# EasyEDA Pro project PicoMiteVGAUSBV1.1.eprj, board PCB3
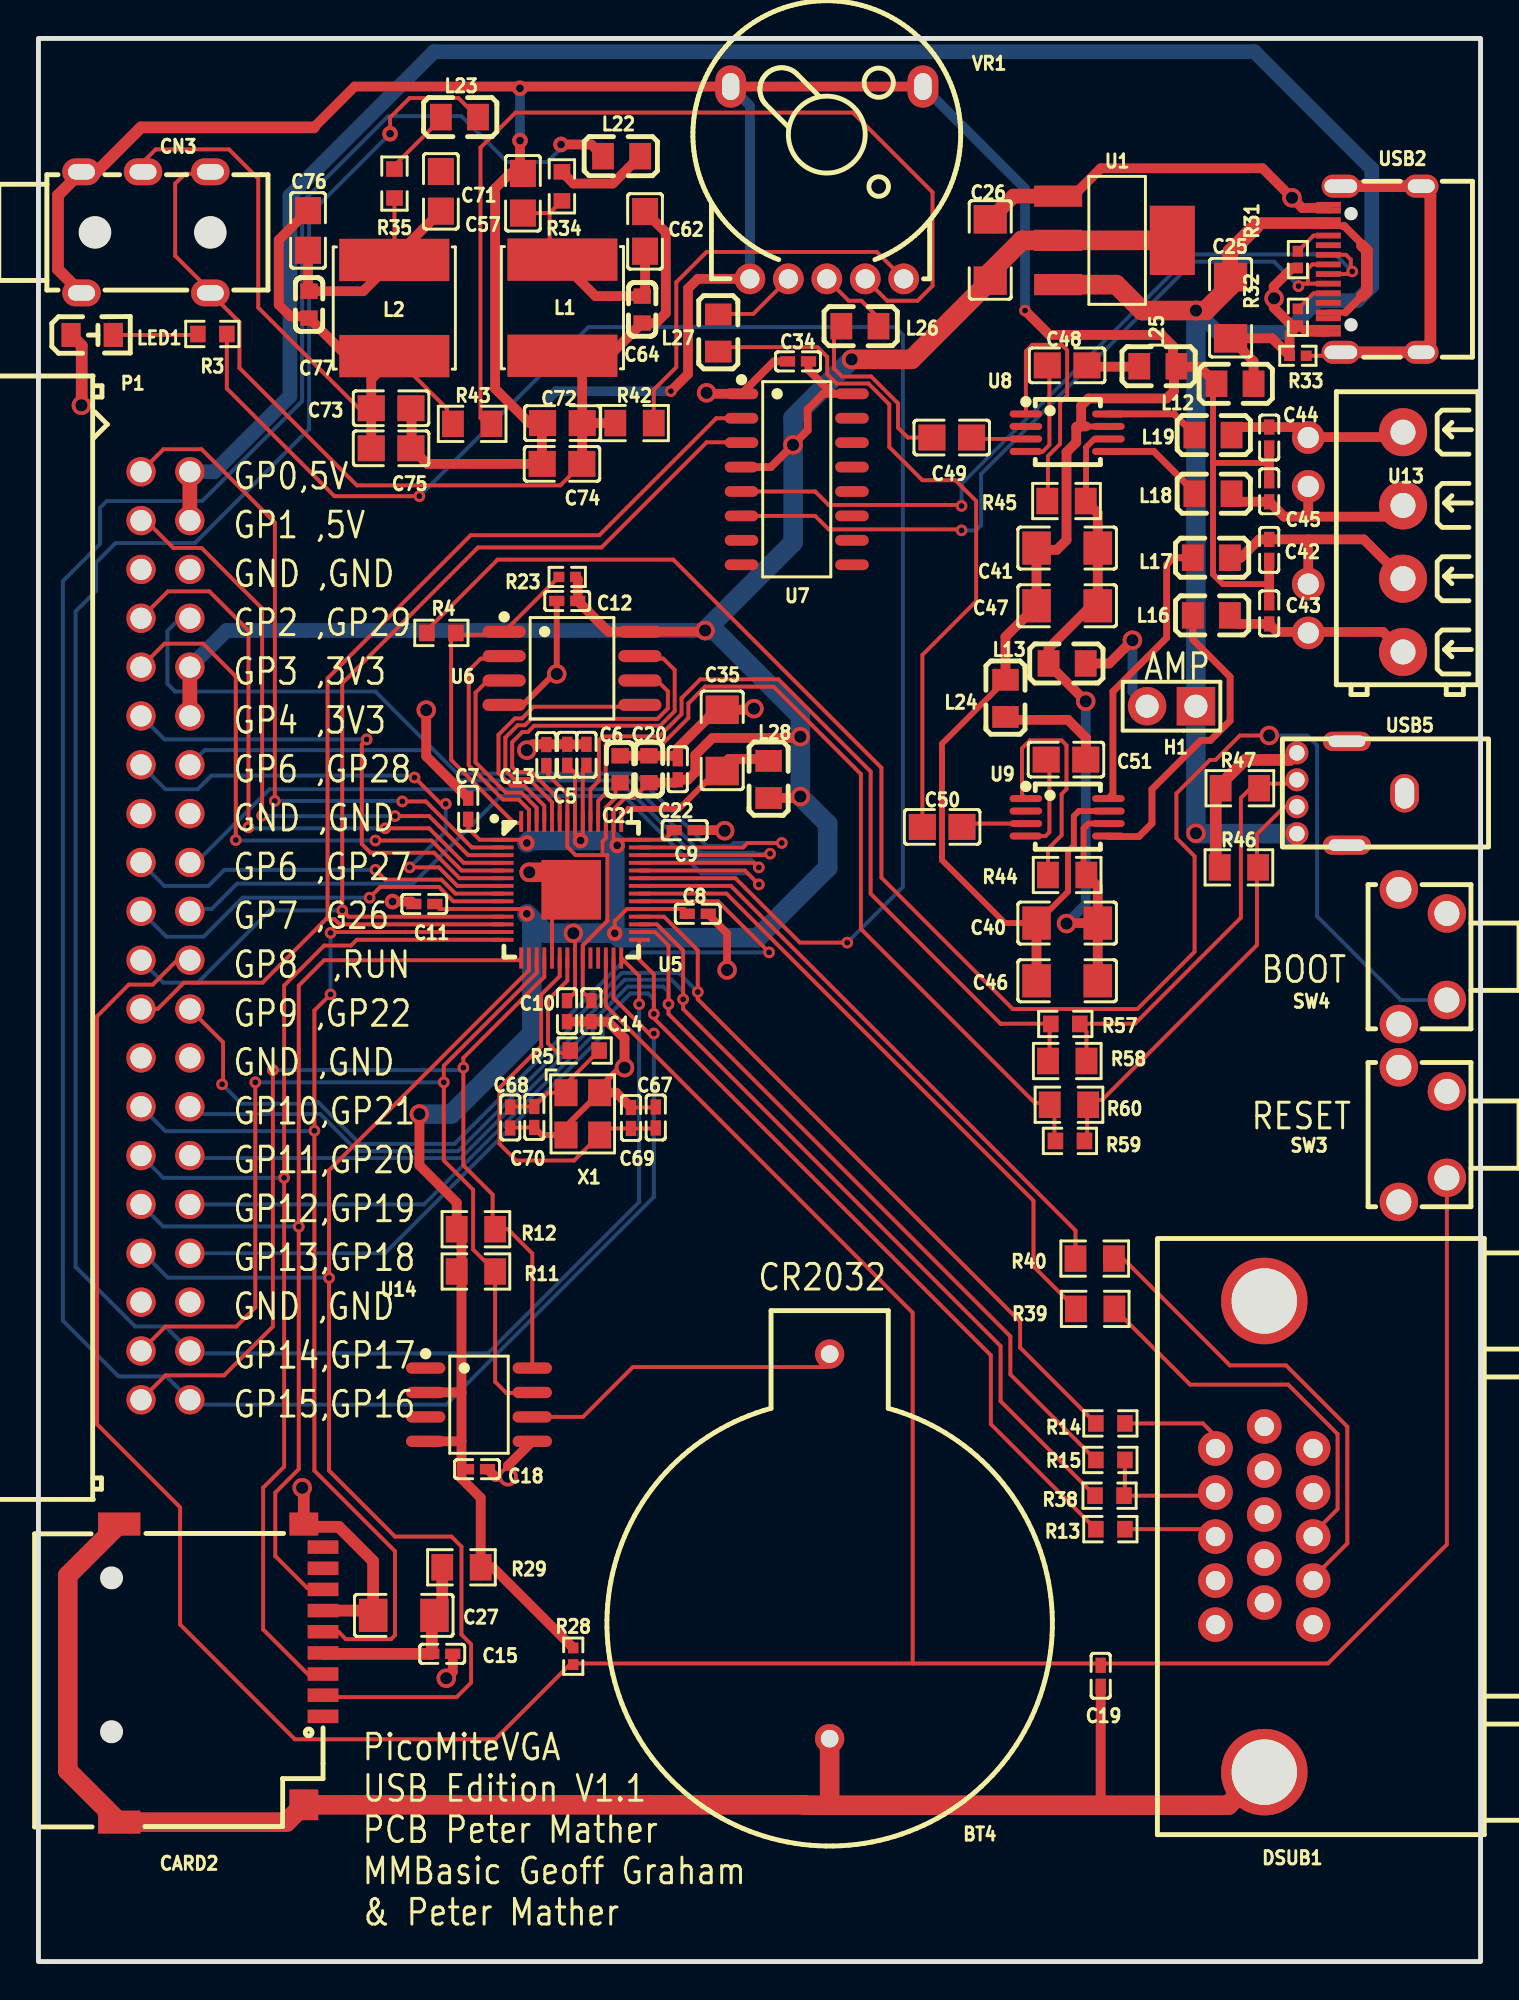
[diagram p1: board, top side]
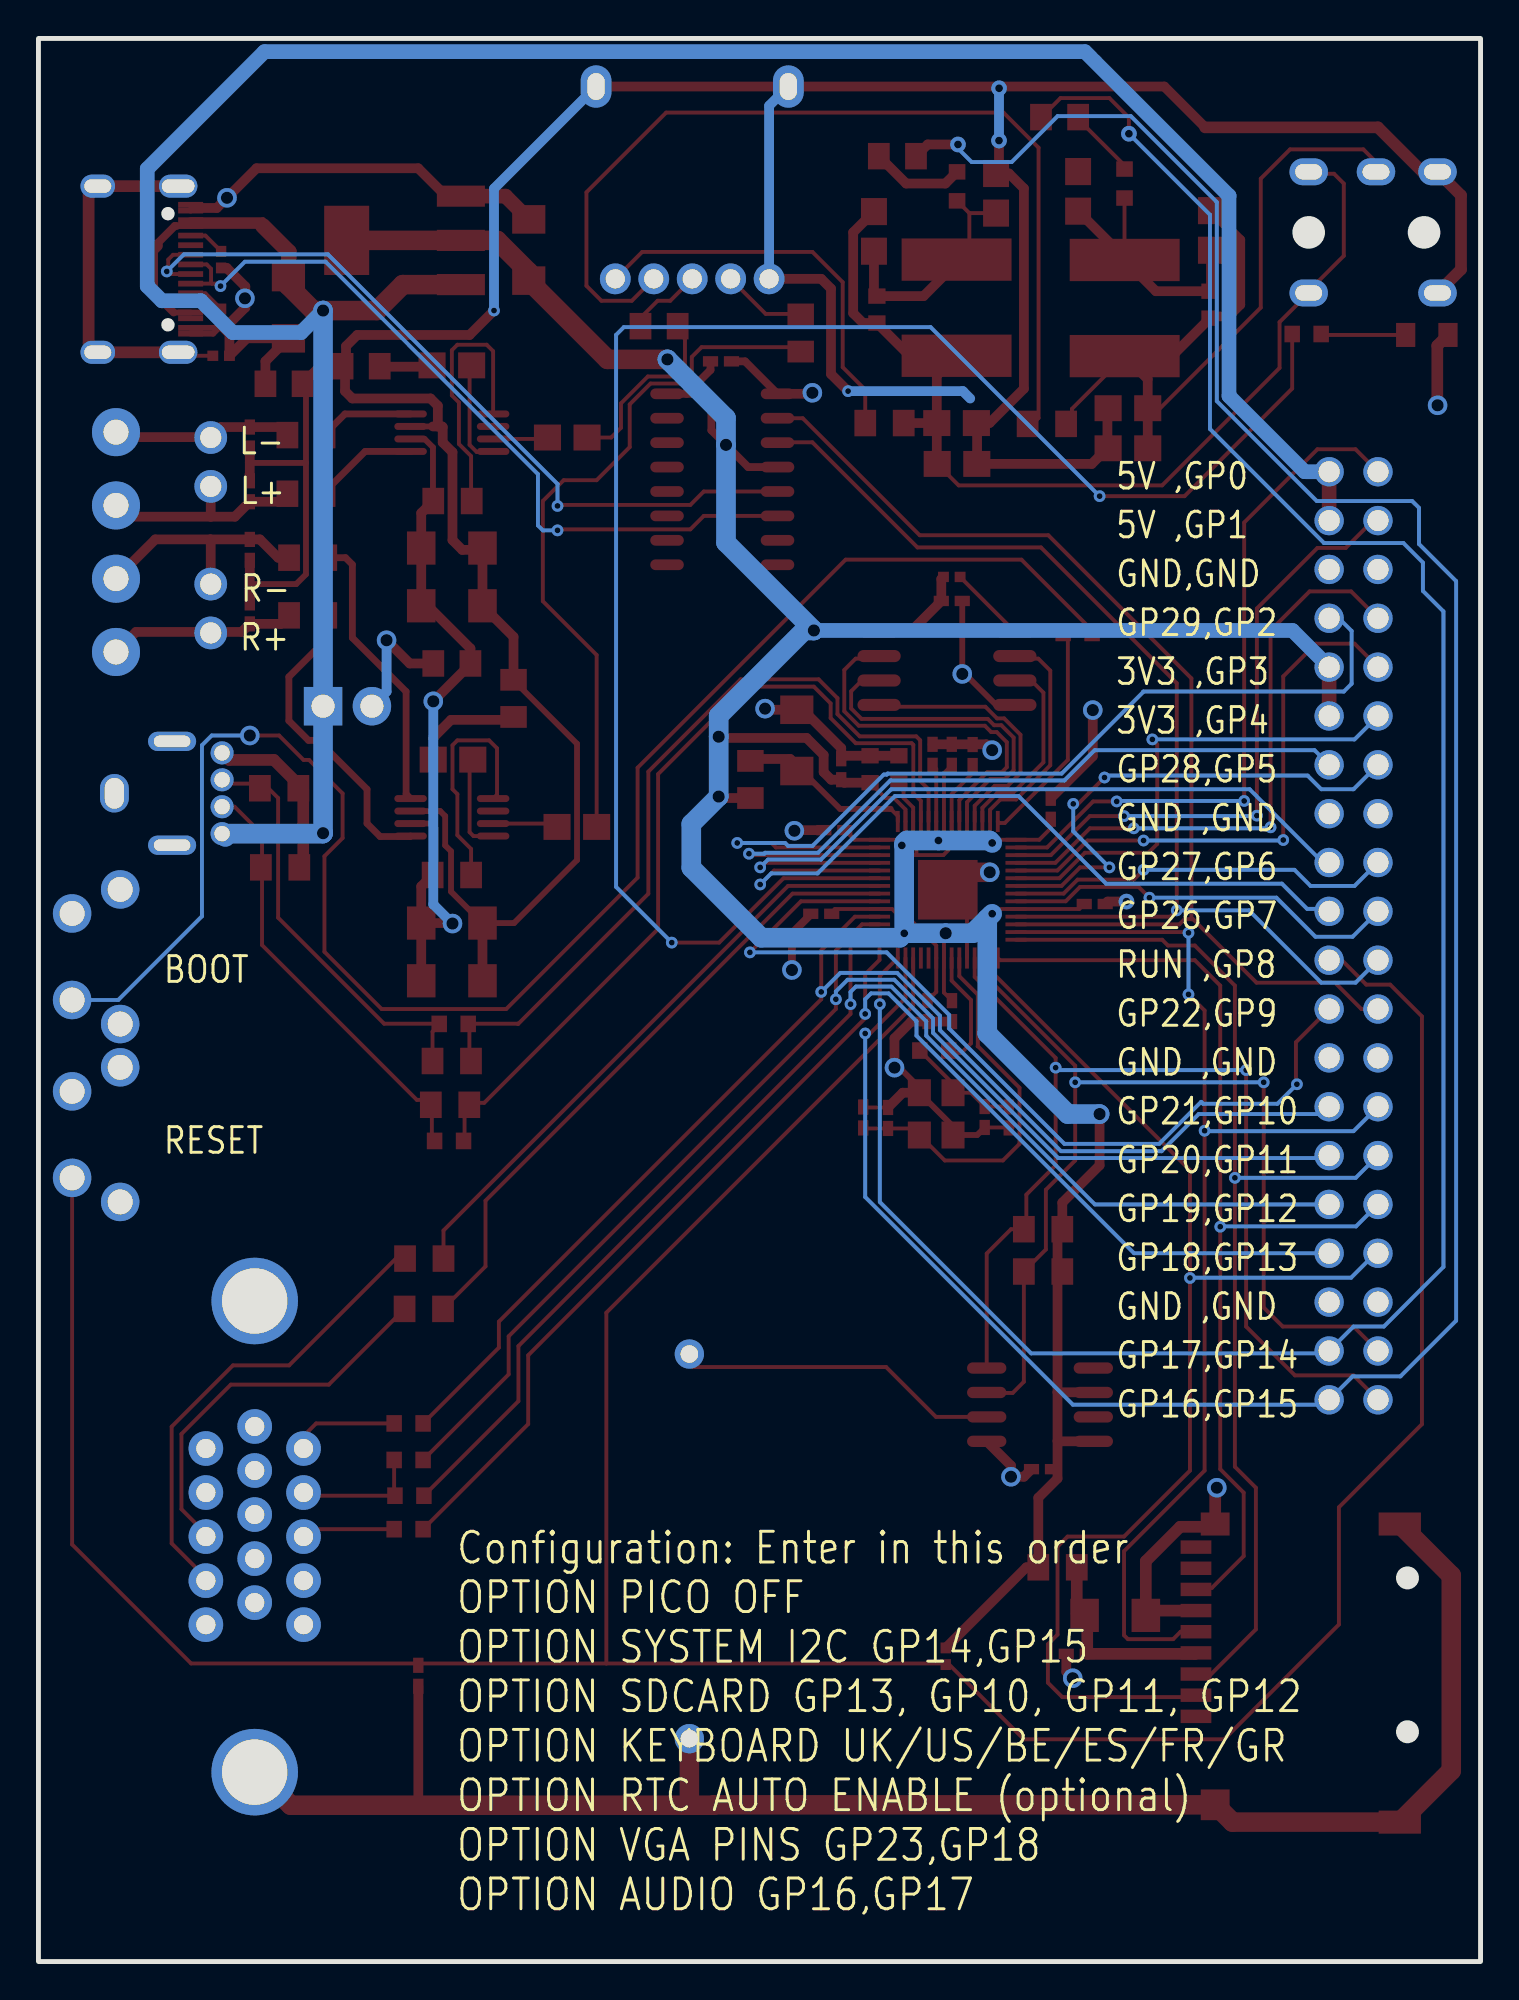
[diagram p2: board, bottom side, seen from below]

Outline 75 x 100 mm; copper layers: Top Layer, Bottom Layer. Coordinates in mm from the lower left corner of the outline.
Outline path: rectangle 75,0 0,100
Stack: Top Layer 0.035mm / Dielectric1 1.51mm FR4 er 4.5 / Bottom Layer 0.035mm

## Design rules (mm)
spacing safeClearance (default): track to track 0.152, other pairs 0.152 to 0.3
track width trackWidth (default): min 0.127, default 0.254, max 2.54
differential pair differentialPair (default): width min 0.127, default 0.254, max 2.54; gap min 0.152, default 0.152
via viaSize (default): diameter min 0.5, default 0.61, max 10; hole min 0.3, default 0.305, max 6

## Placement (name value [footprint] x y rotation side)
BT4  BS-04-A1BJ005  [BAT-TH_BS-04-A1BJ004]  41.15 21.59 90 top
C5  100nF  [C0402_NEW]  27.5 62.75 270 top
C6  100nF  [C0402_NEW]  28.5 62.75 270 top
C7  100nF  [C0402_NEW]  22.35 59.94 270 top
C8  100nF  [C0402_NEW]  34.29 54.48 180 top
C9  100nF  [C0402_NEW]  33.61 58.83 180 top
C10  100nF  [C0402_NEW]  27.49 49.42 90 top
C11  100nF  [C0402_NEW]  20.07 54.99 0 top
C12  100nF  [C0402_NEW]  27.5 70.75 0 top
C13  100nF  [C0402_NEW]  26.42 62.74 90 top
C14  100nF  [C0402_NEW]  28.76 49.42 270 top
C15  100nF  [C0402_NEW]  21 16 0 top
C18  100nF  [C0402_NEW]  22.81 25.6 180 top
C19  100nF  [C0402_NEW]  55.25 14.86 90 top
C20  2.2uF  [C0603]  31.75 62 270 top
C21  2.2uF  [C0603]  30.25 62 90 top
C22  100nF  [C0402_NEW]  33.25 62 270 top
C25  10uF  [C1206]  62 86 90 top
C26  10uF  [C1206]  49.5 89 270 top
C27  10uF  [C1206]  19 18 180 top
C34  100nF  [C0402_NEW]  39.5 83.21 180 top
C35  10uF  [C1206]  35.56 63.5 270 top
C40  10uF  [C1206]  53.5 54 180 top
C41  10uF  [C1206]  53.5 73.5 180 top
C42  220pF  [C0402]  64.01 73.41 90 top
C43  220pF  [C0402]  64.01 70.1 270 top
C44  220pF  [C0402]  64.01 79.25 90 top
C45  220pF  [C0402]  64.01 76.45 270 top
C46  1uF  [C1206]  53.5 51 0 top
C47  1uF  [C1206]  53.5 70.5 0 top
C48  100nF  [C0805]  53.5 83 180 top
C49  100nF  [C0805]  47.5 79.25 0 top
C50  100nF  [C0805]  47 59 0 top
C51  100nF  [C0805]  53.44 62.5 180 top
C57  33nF  [C0805]  25.2 91.95 270 top
C62  2.2nF  [C0805]  31.55 89.97 90 top
C64  470pF  [C0603]  31.39 85.9 270 top
C67  15pF  [C0402]  32.11 43.89 270 top
C68  15pF  [C0402]  24.54 43.89 90 top
C69  15pF  [C0402]  30.82 43.87 270 top
C70  15pF  [C0402]  25.79 43.92 90 top
C71  33nF  [C0805]  20.93 92.05 270 top
C72  33nF  [C0805]  27.25 80 0 top
C73  33nF  [C0805]  18.34 80.77 180 top
C74  33nF  [C0805]  27.23 77.88 0 top
C75  33nF  [C0805]  18.34 78.69 180 top
C76  2.2nF  [C0805]  14.02 90.02 90 top
C77  470pF  [C0603]  14.07 86.16 270 top
CARD2  TF PUSH  [TF-SMD_TF-PUSH]  9.5 15 270 top
CN3  PJ-313 5JCJ  [AUDIO-TH_PJ-313_5JCJ]  5.59 89.92 0 top
DSUB1  D-DMRH15PF-E006  [DSUB-TH_15P-P2.29-H-F_DDMRH15PFE006]  63.75 22.1 90 top
H1  PZ254V-11-02P  [HDR-TH_2P-P2.54-V-M]  58.93 65.28 180 top
L1  4.7mH  [IND-SMD_L6.0-W6.0]  27.25 86 270 top
L2  4.7mH  [IND-SMD_L6.0-W6.0]  18.51 85.98 270 top
L12  BLM21PG221SN1D  [L0805]  62.23 82.04 180 top
L13  BLM21PG221SN1D  [L0805]  53.5 67.5 0 top
L16  BLM21PG221SN1D  [L0805]  61 70 180 top
L17  BLM21PG221SN1D  [L0805]  61 73 180 top
L18  BLM21PG221SN1D  [L0805]  61.09 76.33 180 top
L19  BLM21PG221SN1D  [L0805]  61.09 79.38 180 top
L22  10uH  [L0805]  30.33 93.88 0 top
L23  10uH  [L0805]  21.9 95.91 180 top
L24  10uH  [L0805]  50.29 65.68 270 top
L25  10uH  [L0805]  58.22 82.96 180 top
L26  10uH  [L0805]  42.72 85.04 180 top
L27  10uH  [L0805]  35.36 84.68 270 top
L28  10uH  [L0805]  37.97 61.47 270 top
LED1  NCD0805R1  [LED0805-RD]  2.79 84.58 0 top
NOREF  -  [Pad_e1369]  66.04 71.63 0 top
NOREF#2  -  [Pad_e908]  66.04 79.25 0 top
NOREF#3  -  [Pad_e1368]  66.04 76.71 0 top
NOREF#4  -  [Pad_e919]  66.04 69.09 0 top
P1  2.54-2*20P弯简牛  [IDC-TH_40P-P2.54-C9145]  6.6 53.34 270 top
R3  1kΩ  [R0603]  9.04 84.63 180 top
R4  1kΩ  [R0603]  20.96 69.09 180 top
R5  1kΩ  [R0603]  28.41 47.37 180 top
R11  10kΩ  [R0805]  22.75 35.88 180 top
R12  10kΩ  [R0805]  22.75 38.08 180 top
R13  270Ω  [R0603]  55.75 22.48 0 top
R14  270Ω  [R0603]  55.75 27.98 0 top
R15  390Ω  [R0603]  55.75 26.08 0 top
R23  10kΩ  [R0402]  27.5 72 0 top
R28  10kΩ  [R0402]  27.81 15.88 90 top
R29  2.2Ω  [R0805]  22 20.5 180 top
R31  5.1kΩ  [R0402]  65.5 88.5 90 top
R32  5.1kΩ  [R0402]  65.5 85.5 90 top
R33  1MΩ  [R0402]  65.5 83.5 0 top
R34  220Ω  [R0603]  27.22 92.31 270 top
R35  220Ω  [R0603]  18.52 92.46 270 top
R38  820Ω  [R0603]  55.71 24.22 0 top
R39  47Ω  [R0805]  54.96 33.94 0 top
R40  47Ω  [R0805]  54.93 36.55 0 top
R42  27kΩ  [R0805]  31 80 0 top
R43  27kΩ  [R0805]  22.56 79.96 0 top
R44  10kΩ  [R0805]  53.5 56.5 0 top
R45  10kΩ  [R0805]  53.47 75.95 0 top
R46  15kΩ  [R0805]  62.43 56.9 180 top
R47  15kΩ  [R0805]  62.48 61.01 180 top
R57  150Ω  [R0603]  53.4 48.76 0 top
R58  33Ω  [R0805]  53.5 46.83 0 top
R59  150Ω  [R0603]  53.65 42.67 0 top
R60  33Ω  [R0805]  53.59 44.55 0 top
SW3  TS665ZJ  [SW-TH_TS665ZJ]  72 43 90 top
SW4  TS665ZJ  [SW-TH_TS665ZJ]  72 52.25 90 top
U1  AMS1117-3.3  [SOT-223-3_L6.5-W3.4-P2.30-LS7.0-BR]  56 89.5 180 top
U5  RP2040  [LQFN-56_L7.0-W7.0-P0.4-EP]  27.71 55.73 0 top
U6  W25Q128JVSIQ  [SOIC-8_L5.3-W5.3-P1.27-LS8.0-BL]  27.75 67.25 270 top
U7  CH340C  [SOP-16_L10.0-W3.9-P1.27-LS6.0-BL]  39.44 77.08 270 top
U8  PAM8302AASCR  [MSOP-8_L3.0-W3.0-P0.65-LS5.0-BL]  53.5 79.5 270 top
U9  PAM8302AASCR  [MSOP-8_L3.0-W3.0-P0.65-LS5.0-BL]  53.5 59.5 270 top
U13  DB125-3.81-4P-GN-S  [CONN-TH_DB125-3.81-4P]  70.97 73.81 270 top
U14  DS3231MZ+TRL  [SOIC-8_L4.9-W3.9-P1.27-LS6.0-BL]  22.91 28.96 270 top
USB2  KH-TYPE-C-16P  [USB-C-SMD_KH-TYPE-C-16P]  69.5 88 90 top
USB5  906-561A1024D10200  [USB-A-TH_C39450]  68.25 60.75 90 top
VR1  10kΩ  [RES-TH_RK10J12E002L]  41 92.5 0 top
X1  12MHz  [OSC-SMD_4P-L3.2-W2.5-BL]  28.31 44.08 270 top

## Footprints (pads in the part's own frame, mm; a bottom-side part is the same pattern mirrored in y, then rotated)
AUDIO-TH_PJ-313_5JCJ
  oval 2x1.4 hole 1.4x0.8: 1(-3.35,3.15) 1(-3.35,-3.15) 2(3.35,3.15) 2(3.35,-3.15) 3(-0.15,3.15)
BAT-TH_BS-04-A1BJ004
  round 1.524 hole 0.914: 1(10,0) 2(-10,0)
C0402
  rect 0.79x0.54 smd: 1(-0.545,0) 2(0.545,0)
C0402_NEW
  rect 0.79x0.54 smd: 1(-0.545,0) 2(0.545,0)
C0603
  rect 0.8x0.9 smd: 1(-0.7,0) 2(0.7,0)
C0805
  rect 1.41x1.35 smd: 1(-1.03,0) 2(1.03,0)
C1206
  rect 1.485x1.728 smd: 1(-1.593,0) 2(1.593,0)
CONN-TH_DB125-3.81-4P
  round 2.5 hole 1.3: 1(-5.715,0) 2(-1.905,0) 3(1.905,0) 4(5.715,0)
DSUB-TH_15P-P2.29-H-F_DDMRH15PFE006
  round 1.8 hole 1: 1(4.58,2.54) 2(2.29,2.54) 3(0,2.54) 4(-2.29,2.54) 5(-4.58,2.54) 6(5.725,0) 7(3.435,0) 8(1.145,0) 9(-1.145,0) 10(-3.435,0) 11(4.58,-2.54) 12(2.29,-2.54) 13(0,-2.54) 14(-2.29,-2.54) 15(-4.58,-2.54)
  round 4.5 hole 3.4: 16(-12.25,0) 17(12.25,0)
HDR-TH_2P-P2.54-V-M
  rect 2x2 hole 1.2: 1(-1.27,0)
  round 2 hole 1.2: 2(1.27,0)
IDC-TH_40P-P2.54-C9145
  round 1.524 hole 1.1: 1(-24.13,-1.27) 2(-24.13,1.27) 3(-21.59,-1.27) 4(-21.59,1.27) 5(-19.05,-1.27) 6(-19.05,1.27) 7(-16.51,-1.27) 8(-16.51,1.27) 9(-13.97,-1.27) 10(-13.97,1.27) 11(-11.43,-1.27) 12(-11.43,1.27) 13(-8.89,-1.27) 14(-8.89,1.27) 15(-6.35,-1.27) 16(-6.35,1.27) 17(-3.81,-1.27) 18(-3.81,1.27) 19(-1.27,-1.27) 20(-1.27,1.27) 21(1.27,-1.27) 22(1.27,1.27) 23(3.81,-1.27) 24(3.81,1.27) 25(6.35,-1.27) 26(6.35,1.27) 27(8.89,-1.27) 28(8.89,1.27) 29(11.43,-1.27) 30(11.43,1.27) 31(13.97,-1.27) 32(13.97,1.27) 33(16.51,-1.27) 34(16.51,1.27) 35(19.05,-1.27) 36(19.05,1.27) 37(21.59,-1.27) 38(21.59,1.27) 39(24.13,-1.27) 40(24.13,1.27)
IND-SMD_L6.0-W6.0
  rect 2.2x5.72 smd: 1(-2.5,0) 2(2.5,0)
L0805
  rect 1.133x1.377 smd: 1(-0.966,0) 2(0.966,0)
LED0805-RD
  rect 1x1.25 smd: 1(-1.1,0) 2(1.1,0)
LQFN-56_L7.0-W7.0-P0.4-EP
  rect 1.1x0.2 smd: 1(-3.55,2.6) 2(-3.55,2.2) 3(-3.55,1.8) 4(-3.55,1.4) 5(-3.55,1) 6(-3.55,0.6) 7(-3.55,0.2) 8(-3.55,-0.2) 9(-3.55,-0.6) 10(-3.55,-1) 11(-3.55,-1.4) 12(-3.55,-1.8) 13(-3.55,-2.2) 14(-3.55,-2.6) 29(3.55,-2.6) 30(3.55,-2.2) 31(3.55,-1.8) 32(3.55,-1.4) 33(3.55,-1) 34(3.55,-0.6) 35(3.55,-0.2) 36(3.55,0.2) 37(3.55,0.6) 38(3.55,1) 39(3.55,1.4) 40(3.55,1.8) 41(3.55,2.2) 42(3.55,2.6)
  rect 0.2x1.1 smd: 15(-2.6,-3.55) 16(-2.2,-3.55) 17(-1.8,-3.55) 18(-1.4,-3.55) 19(-1,-3.55) 20(-0.6,-3.55) 21(-0.2,-3.55) 22(0.2,-3.55) 23(0.6,-3.55) 24(1,-3.55) 25(1.4,-3.55) 26(1.8,-3.55) 27(2.2,-3.55) 28(2.6,-3.55) 43(2.6,3.55) 44(2.2,3.55) 45(1.8,3.55) 46(1.4,3.55) 47(1,3.55) 48(0.6,3.55) 49(0.2,3.55) 50(-0.2,3.55) 51(-0.6,3.55) 52(-1,3.55) 53(-1.4,3.55) 54(-1.8,3.55) 55(-2.2,3.55) 56(-2.6,3.55)
  rect 3.1x3.1 smd: 57(0,0)
MSOP-8_L3.0-W3.0-P0.65-LS5.0-BL
  oval 0.364x1.692 smd: 1(-0.975,-2.146) 2(-0.325,-2.146) 3(0.325,-2.146) 4(0.975,-2.146) 5(0.975,2.146) 6(0.325,2.146) 7(-0.325,2.146) 8(-0.975,2.146)
OSC-SMD_4P-L3.2-W2.5-BL
  rect 1.4x1.2 smd: 1(-1.1,-0.875) 2(1.1,-0.875) 3(1.1,0.875) 4(-1.1,0.875)
Pad_e908
  round 1.7 hole 1.1: 58(0,0)
Pad_e919
  round 1.7 hole 1.1: 61(0,0)
Pad_e1368
  round 1.7 hole 1.1: 58(0,0)
Pad_e1369
  round 1.7 hole 1.1: 58(0,0)
R0402
  rect 0.566x0.54 smd: 1(-0.433,0) 2(0.433,0)
R0603
  rect 0.806x0.864 smd: 1(-0.753,0) 2(0.753,0)
R0805
  rect 1.133x1.377 smd: 1(-1,0) 2(1,0)
RES-TH_RK10J12E002L
  round 1.6 hole 1: 1(-4,-5) 2(0,-5) 3(2,-5) 4(-2,-5) 5(4,-5)
  oval 1.6x2.2 hole 0.9x1.4: 6(5,5) 7(-5,5)
SOIC-8_L4.9-W3.9-P1.27-LS6.0-BL
  oval 0.588x2.045 smd: 1(-1.905,-2.772) 2(-0.635,-2.772) 3(0.635,-2.772) 4(1.905,-2.772) 5(1.905,2.772) 6(0.635,2.772) 7(-0.635,2.772) 8(-1.905,2.772)
SOIC-8_L5.3-W5.3-P1.27-LS8.0-BL
  oval 0.63x2.25 smd: 1(-1.905,-3.53) 2(-0.635,-3.53) 3(0.635,-3.53) 4(1.905,-3.53) 5(1.905,3.53) 6(0.635,3.53) 7(-0.635,3.53) 8(-1.905,3.53)
SOP-16_L10.0-W3.9-P1.27-LS6.0-BL
  oval 0.56x1.745 smd: 1(-4.445,-2.873) 2(-3.175,-2.873) 3(-1.905,-2.873) 4(-0.635,-2.873) 5(0.635,-2.873) 6(1.905,-2.873) 7(3.175,-2.873) 8(4.445,-2.873) 9(4.445,2.873) 10(3.175,2.873) 11(1.905,2.873) 12(0.635,2.873) 13(-0.635,2.873) 14(-1.905,2.873) 15(-3.175,2.873) 16(-4.445,2.873)
SOT-223-3_L6.5-W3.4-P2.30-LS7.0-BR
  rect 2.5x1.1 smd: 1(2.97,-2.3) 2(2.97,0) 3(2.97,2.3)
  rect 2.34x3.6 smd: 4(-2.97,0)
SW-TH_TS665ZJ
  round 2 hole 1.3: 1(-2.25,-1.25) 2(2.25,-1.25) 3(-3.5,1.25) 4(3.5,1.25)
TF-SMD_TF-PUSH
  rect 0.7x1.6 smd: 1(2.25,5.3) 2(1.15,5.3) 3(0.05,5.3) 4(-1.05,5.3) 5(-2.15,5.3) 6(-3.25,5.3) 7(-4.35,5.3) 8(-5.45,5.3) CD(-6.55,5.3)
  rect 1.2x1.5 smd: 10(-7.75,4.3)
  rect 1.2x2.2 smd: 11(-7.75,-5.3) 12(7.75,-5.3)
  rect 1.6x1.5 smd: 13(6.85,4.3)
USB-A-TH_C39450
  round 1.2 hole 0.8: 1(-2.1,2.8) 2(-0.7,2.8) 3(0.7,2.8) 4(2.1,2.8)
  oval 1x2.5 hole 0.6x1.9: 5(2.7,0.2) 6(-2.7,0.2)
  oval 2x1.5 hole 1.6x1: 7(0,-2.8)
USB-C-SMD_KH-TYPE-C-16P
  oval 1.2x2 hole 0.7x1.7: 1(-4.32,1.765) 2(4.32,1.765)
  oval 1.2x1.8 hole 0.7x1.4: 3(-4.32,-2.415) 4(4.32,-2.415)
  rect 0.3x1.3 smd: A1(-3.35,2.415) A4(-2.55,2.415) A5(-1.25,2.415) A6(-0.25,2.415) A7(0.25,2.415) A8(1.25,2.415) A9(2.55,2.415) A12(3.35,2.415) B1(3.05,2.415) B4(2.25,2.415) B5(1.75,2.415) B6(0.75,2.415) B7(-0.75,2.415) B8(-1.75,2.415) B9(-2.25,2.415) B12(-3.05,2.415)

## Nets
As in the schematic, except:
$1N189613: C43.2 L16.1 NOREF#4.61 U13.4
$1N189618: C42.2 L17.1 NOREF.58 U13.3
$1N189623: C45.2 L18.1 NOREF#3.58 U13.2
$1N189653: C44.2 L19.1 NOREF#2.58 U13.1

Pads without a net: CARD2 1 8 CD; DSUB1 4 9 11 12 15; U5 24 25; U7 7 8 9 10 11 12 13 14 15; U8 2; U9 2; U14 1 3; USB2 A8 B8

## Via types
v1: diameter 1.016, hole 0.635, Top Layer to Bottom Layer, 28 vias
v2: diameter 0.813, hole 0.406, Top Layer to Bottom Layer, 10 vias
v3: diameter 0.61, hole 0.305, Top Layer to Bottom Layer, 45 vias

## Routing (per net, layer and track width the routed paths; a pad name or vN(x,y) marks a point on that pad's centre or on a via; arc(x,y) is an arc through that point)
1V1: length 19.4
  Top Layer w0.203: 30.01,61.43 30.01,60.51 29.51,60.01 U5.45 29.51,58.42 ; 29.34,57.54 29.58,57.54 29.59,57.52 29.59,54.12 28.31,52.83 U5.23 28.31,50.42 C14.1 ; 29.34,57.54 29.34,58.25 29.51,58.42 ; 29.34,57.54 27.93,57.54 27.51,57.96 U5.50 27.51,60.7 26.5,61.71 26.5,62.2 ; 29.51,58.42 29.51,58.42
+5V: length 159.8
  Top Layer w0.305: 67.97,85.75 USB2.B9 ; 67.82,90.25 USB2.B4 63.33,90.25 63.33,90.55 USB2.A9
  Top Layer w0.406: 68.83,86.61 67.97,85.75 ; 67.82,90.25 67.91,90.25 68.83,89.32 68.83,89.23
  Top Layer w0.61: 68.83,89.23 69.09,88.98 69.09,86.87 68.83,86.61
  Top Layer w0.762: P1.2 P1.4
  Top Layer w0.813: 63.33,90.25 61.98,88.9 61.98,87.62 C25.2
  Top Layer w1.016: C25.2 62,87.15 60.71,85.85 v1(60.2,85.85) 57.4,85.85 56.05,87.2 U1.3
  Bottom Layer w0.762: P1.2 9.14,77.47 13.08,81.41 13.08,91.82 20.57,99.31 63.25,99.31 69.34,93.22 69.34,87.12 68.58,86.36 66.55,86.36 64.9,84.71 61.34,84.71 v1(60.2,85.85)
  Bottom Layer w1.016: 65.28,58.48 USB5.1 60.22,58.65 v1(60.2,58.67) H1.1 v1(60.2,85.85)
AVDD: length 9.5
  Top Layer w0.203: 30.68,59.94 30.31,59.57 U5.43 ; 35,61.63 35,61.91
  Top Layer w0.305: 30.68,59.94 30.69,59.93 33.31,59.93 35,61.63
  Top Layer w0.508: 38,62.53 35.91,62.53 35,61.63
GND: length 210.5
  Top Layer w0.203: C69.1 32.08,44.41 C67.1 ; U5.19 26.71,54.73 27.6,55.63 ; v1(37.21,65.15) 37.15,65.09 ; C70.1 24.33,43.37
  Top Layer w0.305: 26.96,70.5 v1(26.96,66.95) 26.81,66.95 25.15,65.3 24.72,65.3 ; 53.8,91.8 U1.1 ; 29.17,45.43 30.22,46.48 v1(30.48,46.48) ; X1.4 27.44,43.43 X1.2 26.18,42.98 C70.1 ; 65.62,84.95 65.92,84.65 USB2.A1 ; 65.62,84.95 USB2.B12 ; 65.62,84.95 R32.1 ; USB2.B1 66.95,91.19
  Top Layer w0.406: 38.96,83.21 38.25,83.21 U7.1 ; v1(35.81,51.56) 35.81,53.47 34.91,54.37
  Top Layer w0.508: X1.4 30.05,45.18 C69.1 ; C6.1 C5.1 25.7,63.3 v1(25.4,62.99) ; 55.34,8.13 55.25,8.22 C19.1 ; U7.1 34.8,81.52 v1(34.75,81.57) ; C9.1 35.66,58.83 v1(35.69,58.8) ; 66.95,91.19 65.72,91.19 v1(65.19,91.71) 63.66,93.25 55.25,93.25 53.8,91.8 ; R31.1 65.21,88.07 64.24,87.1 64.24,86.01 65.18,85.07 R32.1 65.07,84.63 R33.1 64.16,84.41 C25.1 63.2,83.21 L12.1 ; C7.1 20.17,62.67 v1(20.17,65.08) ; C18.1 23.75,25.21 v1(24.42,25.21) 24.42,25.79 U14.5 ; v2(18.41,55.12) 19.39,55.12 19.52,54.99 ; C10.1 C14.2 29.61,48.88 30.48,48.01 v1(30.48,46.48) ; C21.2 C20.1 33.09,62.7 C22.1 33.25,63.09 35.25,65.09 C35.1 37.15,65.09 ; C15.2 21.54,15.07 v1(21.21,14.73)
  Top Layer w0.61: v1(13.72,24.64) 13.8,24.55 CARD2.10 13.94,22.61 15.62,22.61 17.41,20.82 C27.2 17.16,18.25 CARD2.6 ; v1(2.23,80.92) 2.25,80.94 2.25,84.03 LED1.1 ; 61.23,56.9 61.23,60.96 62.75,62.48 65.08,62.48 USB5.4
  Top Layer w0.762: U1.1 50.71,91.8 C26.1
  Top Layer w1.016: 41.15,8.13 BT4.2 ; 41.15,8.13 39.88,8.13 39.86,8.15 CARD2.13 12.9,7.25 CARD2.12 1.52,9.93 1.52,20.07 CARD2.11 ; 41.15,8.13 61.88,8.13 64,10.25 ; v1(25.53,56.64) 26.59,56.64 27.6,55.63 U5.57
  vias: v1(64.26,86.49)
VCC: length 221.4
  Top Layer w0.203: v2(25.4,58.17) 25.23,58.33 U5.1 22.95,58.33 22.35,58.93 C7.2 ; C11.2 20.87,54.73 U5.10 25.15,54.73 v2(25.4,54.48) ; v2(29.97,53.47) 29.97,54.1 30.6,54.73 U5.33 33.58,54.73 33.83,54.48 ; v1(27.82,53.47) 27.91,53.38 U5.22 27.91,50.39 C10.2 ; 22,35.63 R11.2 ; C5.2 27.91,61.8 U5.49 27.91,58.58 v2(28.19,58.29) 28.31,58.41 U5.48 28.31,62.01 C6.2 ; C20.2 30.96,60.51 30.5,60.51 30.5,60.5 29.91,59.91 U5.44 29.91,58.23 v2(30.1,58.04) 30.39,58.33 U5.42 32.56,58.33 C9.2
  Top Layer w0.305: 22,37.83 R12.2
  Top Layer w0.406: U7.16 41.29,81.52 ; 41.29,81.52 40.05,82.76 C34.1 ; 41.29,81.52 40.82,81.52 40,80.71 40,79.63 v1(39.24,78.87) 38.09,77.71 U7.4
  Top Layer w0.508: U14.4 21.98,27.05 22,27.07 ; v1(34.67,69.22) 34.61,69.16 U6.8 29.64,69.16 C12.2 28.04,71.89 R23.2 ; 22,37.83 22,29.6 ; 39.62,63.63 35.05,63.63 34.16,62.74 34.16,61.85 33.77,61.45 C22.2 33.09,61.3 C20.2 ; 20.14,29.59 20.15,29.6 22,29.6 ; 22,27.07 22,29.6 ; 22,27.07 22,25.12 23,24.12 R29.1 23.62,20.5 R28.2 ; v1(39.62,60.58) 39.55,60.5 L28.2 ; R12.2 21.75,39.46 19.81,41.4 v1(19.81,44.07)
  Top Layer w0.762: P1.10 P1.12
  Top Layer w1.016: U1.4 U1.2 51.15,89.5 49.5,87.85 C26.2 45.4,83.31 v1(42.29,83.31)
  Bottom Layer w0.762: P1.10 9.78,69.22 v1(34.67,69.22)
  Bottom Layer w1.016: v2(29.97,53.47) 29.97,53.47 v1(27.82,53.47) 26.41,53.47 25.65,54.23 ; v2(29.97,53.47) 30.2,53.24 37.41,53.24 41.05,56.88 41.05,59.16 v1(39.62,60.58) v1(39.62,63.69) 39.62,64.77 35.18,69.22 v1(34.67,69.22) 39.24,73.79 v1(39.24,78.87) 39.24,80.26 v1(42.29,83.31) ; v2(29.97,53.47) 29.97,58.17 29.84,58.29 v2(28.19,58.29) 25.53,58.29 v2(25.4,58.17) ; 25.65,54.23 v2(25.4,54.48) ; 25.65,54.23 25.65,48.26 21.46,44.07 v1(19.81,44.07)
A-GND: length 209.4
  Top Layer w0.305: 61.09,77.93 63.99,77.93 64.01,77.94 ; 61.09,77.93 61.09,81.86 L12.2 ; 61.09,77.93 61.09,72.14 61.59,71.63 63.97,71.63 64.01,71.59 ; U9.7 54.11,59.83 53.85,59.56 53.85,58.04 53.54,57.73 53.54,55.64 C40.2 50.27,54 46.99,57.28 46.99,63.32 50.16,66.5 ; U8.7 54.48,79.83
  Top Layer w0.508: 19.41,78.69 19.41,80.41 19.04,80.77 ; 19.41,78.69 20.22,77.88 C74.1 26.18,77.89 26.18,80.01 25.53,80.01 23.75,81.79 23.75,92.2 24.53,92.98 C57.1 25.04,93.13 v2(25.04,94.69) ; 19.41,78.69 19.41,78.49 ; 59,82.93 59,84 58.42,84.58 52.58,84.58 v3(51.31,85.85) ; 59,82.93 59.06,82.88 59.06,81.66 58.67,81.28 54.61,81.28 54.23,80.9 54.23,79.83 ; 59,82.93 60.38,82.93 L12.2 ; v3(32.89,81.66) 33.78,82.55 33.78,86.99 34.29,87.5 VR1.1 ; C45.1 C44.1 ; 54.48,79.83 54.23,79.83 ; 54.23,79.83 54.01,79.83 53.97,79.79 53.97,78.99 53.47,78.49 53.47,73.91 52.96,73.41 52,73.41 C41.2 C47.1 50.29,68.88 50.29,66.62 50.16,66.5 ; C43.1 C42.1 ; VR1.6 VR1.7 16.45,97.5 14.32,95.38 ; C46.1 C40.2
  Top Layer w0.61: 14.32,95.38 5.33,95.38 3.02,93.07 CN3.1 1.02,91.84 1.02,87.99 CN3.1
  Bottom Layer w0.508: v3(32.89,81.66) 26.92,81.66 26.54,81.28 ; VR1.1 37,96.5 VR1.7 ; v2(25.04,94.69) 25.04,97.41 v2(25.04,97.41) ; v3(51.31,85.85) 51.31,92.19 VR1.6
A-PWR: length 40.1
  Top Layer w0.305: U9.6 54.6,59.17 54.36,58.93 54.36,56.64 R44.2 ; U8.6 54.92,79.17 54.48,78.74 54.48,75.96 R45.2
  Top Layer w0.508: R44.2 55.09,55.91 C40.1 ; v1(53.47,53.97) 53.49,54 C40.1 ; v1(54.47,65.53) 52.53,67.46 L13.1 52.53,68.28 54.75,70.5 C47.2 C41.1 55.09,75.32 R45.2 ; C40.1 C46.2
  Bottom Layer w0.508: v1(53.47,53.97) 54.47,54.97 v1(54.47,65.53)
AMP_PWR: length 6.7
  Top Layer w0.508: L13.2 55.69,67.5 v1(56.9,68.71)
  Bottom Layer w0.508: H1.2 56.9,66.04 v1(56.9,68.71)
GP0: length 36.4
  Top Layer w0.203: U5.2 22.54,57.93 20.15,60.33 v3(18.92,60.33) ; v3(12.29,60.35) 12.29,74.83 8.48,78.64 6.5,78.64 P1.1
  Bottom Layer w0.203: v3(12.29,60.35) 18.9,60.35 v3(18.92,60.33)
GP1: length 32.3
  Top Layer w0.203: v3(11.63,59.59) 11.63,70.36 8.48,73.51 7.01,73.51 5.59,74.93 P1.3 ; v3(18.54,59.56) 20.32,59.56 22.35,57.53 U5.3
  Bottom Layer w0.203: v3(18.54,59.56) 11.66,59.56 v3(11.63,59.59)
GP2: length 31.2
  Top Layer w0.203: U5.4 22.12,57.13 20.32,58.93 v3(18.03,58.93) ; P1.7 6.73,71.25 8.89,71.25 10.92,69.22 v3(10.92,58.98)
  Bottom Layer w0.203: v3(18.03,58.93) 10.97,58.93 v3(10.92,58.98)
GP3: length 29.2
  Top Layer w0.203: v3(10.26,58.32) 10.26,66.83 8.56,68.53 6.55,68.53 P1.9 ; v3(17.53,58.29) 20.45,58.29 22.01,56.73 U5.5
  Bottom Layer w0.203: v3(17.53,58.29) 10.29,58.29 v3(10.26,58.32)
GP4: length 25.9
  Top Layer w0.203: U5.6 21.9,56.33 20.57,57.66 17.27,57.66 16.81,58.11 16.81,63.3 v3(17.07,63.55)
  Bottom Layer w0.203: v3(17.07,63.55) 6.55,63.55 P1.11
GP5: length 26.6
  Top Layer w0.203: v3(21.18,60.2) 20.93,60.2 v3(19.56,61.57) ; U5.7 21.79,55.93 20.83,56.9 v3(19.3,56.9)
  Bottom Layer w0.203: v3(21.18,60.2) 21.18,58.78 v3(19.3,56.9) ; P1.13 6.6,60.96 8.28,60.96 8.99,61.67 19.46,61.67 v3(19.56,61.57)
GP6: length 20.2
  Top Layer w0.203: v3(17.53,56.77) 18.03,56.26 20.96,56.26 21.68,55.53 U5.8
  Bottom Layer w0.203: P1.17 6.55,55.93 8.84,55.93 9.68,56.77 v3(17.53,56.77)
GP7: length 20.8
  Top Layer w0.203: U5.9 21.58,55.13 20.83,55.88 17.78,55.88 v3(17.22,55.32)
  Bottom Layer w0.203: P1.19 6.66,53.29 8.58,53.29 10.62,55.32 v3(17.22,55.32)
GP8: length 58.8
  Top Layer w0.203: U7.3 36.55,79 34.75,79 29.28,73.53 22.86,73.53 15.8,66.47 v3(15.8,54.66) 16.13,54.33 U5.11
  Bottom Layer w0.203: P1.21 6.5,50.9 8.28,50.9 12.04,54.66 v3(15.8,54.66)
GP9: length 60.5
  Top Layer w0.203: 15.04,54.2 15.04,66.73 22.48,74.17 29.17,74.17 35.25,80.25 U7.2 ; 15.04,54.2 15.39,54.2 15.66,53.93 U5.12 ; 15.04,54.2 14.95,54.2 11.65,50.9 7.57,50.9 6.2,49.53 P1.23
GP10: length 61.1
  Top Layer w0.203: v3(15.19,53.49) 15.23,53.53 U5.13 ; v3(15.19,50.29) 14.35,49.45 v3(14.35,43.2) 14.35,25.53 18.54,21.34 18.54,16.97 18.34,16.76 15.99,16.76 15.6,17.15 CARD2.5
  Bottom Layer w0.203: 14.35,43.18 6.6,43.18 P1.27 ; v3(15.19,53.49) v3(15.19,50.29)
GP11: length 58.4
  Top Layer w0.203: U5.14 16.56,53.13 16.26,52.83 14.86,52.83 12.78,50.75 v3(12.78,40.75) 12.78,25.73 11.68,24.64 11.68,17.27 14.1,14.86 14.71,14.86 CARD2.3
  Bottom Layer w0.203: P1.29 6.49,40.75 v3(12.78,40.75)
GP12: length 54.1
  Top Layer w0.203: CARD2.7 14.72,19.43 13.97,19.43 12.32,21.08 12.32,24.38 13.54,25.6 v3(13.54,38.21) 13.54,50.75 14.86,52.07 25,52.07 U5.15
  Bottom Layer w0.203: 13.46,38.23 6.48,38.23 P1.31
GP13: length 65.1
  Top Layer w0.203: U5.16 25.51,51.54 15.11,41.15 v3(15.11,35.55) 15.11,25.53 18.54,22.1 21.48,22.1 22,21.58 22,17 22.5,16.5 22.5,14.5 21.75,13.75 14.9,13.75 CARD2.2
  Bottom Layer w0.203: 15.11,35.56 6.73,35.56 5.46,36.83 P1.33
GP14: length 55.7
  Top Layer w0.203: 25.68,29.59 25.66,29.57 24.33,29.57 23.75,30.15 R11.1 22.61,37.03 22.61,40.13 21.08,41.66 v3(21.08,45.72) 21.08,46.58 25.91,51.41 U5.17 ; P1.37 6.6,33.02 10.29,33.02 11.28,34.01 v3(11.28,45.72)
  Bottom Layer w0.203: v3(11.28,45.72) v3(21.08,45.72)
GP15: length 56.7
  Top Layer w0.203: v3(12.19,46.36) 12.19,33.02 9.65,30.48 6.6,30.48 P1.39 ; U14.8 25.68,36.82 24.42,38.08 R12.1 23.62,38.21 23.62,39.88 22.1,41.4 v3(22.1,46.48) 22.1,46.99 26.31,51.2 U5.18
  Bottom Layer w0.203: v3(22.1,46.48) 21.97,46.36 v3(12.19,46.36)
GP16: length 135.9
  Top Layer w0.203: U5.27 29.91,50.1 31.75,48.26 v3(32,48.26)
  Top Layer w0.508: v2(27.18,94.49) 28.75,94.49 L22.1
  Bottom Layer w0.203: v3(32,48.26) 32,39.76 21.2,28.96 8.13,28.96 P1.40 6.66,30.43 4.17,30.43 1.27,33.33 1.27,71.78 3.2,73.71 3.2,75.59 3.56,75.95 8.52,75.95 13.72,81.14 13.72,91.49 18.19,95.96 22,95.96 24.38,93.57 26.47,93.57 27.18,94.28 v2(27.18,94.49)
GP17: length 122
  Top Layer w0.203: 22.81,95.76 22.81,95.94 21.84,96.9 19.3,96.9 18.29,95.89 v2(18.29,95.05) ; v3(31.24,49.78) 31.24,51.25 U5.28
  Bottom Layer w0.203: v2(18.29,95.05) 14.07,90.83 14.07,79.69 8.14,73.76 4.01,73.76 3,72.75 3,71.27 1.93,70.21 1.93,36.12 5.03,33.02 6.6,33.02 P1.38 8,31.62 23.37,31.62 31.24,39.5 v3(31.24,49.78)
GP18: length 71.5
  Top Layer w0.203: U5.29 31.26,52.08 32,51.34 v3(32,49.28) 32,49.05 49.53,31.52 49.53,27.95 R13.1
  Bottom Layer w0.203: v3(32,49.28) 32,50.04 31.7,50.34 30.78,50.34 29.34,48.89 29.34,48.15 18.02,36.83 P1.34
GP19: length 70.4
  Top Layer w0.203: U5.30 32.07,53.53 32.77,52.83 v3(32.77,49.78) 32.77,49.28 50.04,32 50.04,29.14 R38.1
  Bottom Layer w0.203: P1.32 20.06,39.37 28.83,48.14 28.83,48.89 30.64,50.7 32.49,50.7 32.77,50.42 v3(32.77,49.78)
GP20: length 68.9
  Top Layer w0.203: R15.1 50.55,30.53 50.55,32.51 33.53,49.53 v3(33.53,50.04) 33.53,52.57 32.17,53.93 U5.31
  Bottom Layer w0.203: P1.30 8,41.78 21.97,41.78 28.47,48.29 28.47,49.04 30.49,51.05 32.92,51.05 33.53,50.44 v3(33.53,50.04)
GP21: length 69
  Top Layer w0.203: R14.1 51.05,31.92 51.05,33.27 34.29,50.04 v3(34.29,50.42) 34.29,52.58 32.54,54.33 U5.32
  Bottom Layer w0.203: v3(34.29,50.42) 33.3,51.41 30.34,51.41 28.12,49.18 28.12,48.44 21.82,42.14 16.59,42.14 14.66,44.07 8.25,44.07 P1.28
GP22: length 46.8
  Top Layer w0.203: U5.34 35.34,55.13 v3(38,52.48) ; v3(9.55,45.62) 9.6,45.67 9.6,47.8 P1.24
  Bottom Layer w0.203: v3(38,52.48) 30.89,52.48 27.63,49.22 27.63,48.51 21.64,42.52 16.71,42.52 14.53,44.7 14.43,44.6 10.57,44.6 v3(9.55,45.62)
GP23: length 33.6
  Top Layer w0.203: U5.35 35.78,55.53 51.75,39.56 51.75,36.15 R39.1
GP24: length 31.6
  Top Layer w0.203: R40.1 53.93,38.01 36.02,55.93 U5.36
GP25: length 89.1
  Top Layer w0.203: R3.1 9.8,81.8 15.39,76.2 v3(19.81,76.2) ; U5.37 36.25,56.33 39.6,52.98 v3(42.06,52.98)
  Bottom Layer w0.203: v3(19.81,76.2) 28.6,84.99 44.55,84.99 44.96,84.58 44.96,55.88 v3(42.06,52.98)
GP26: length 40.5
  Top Layer w0.203: v3(37.47,56.01) 36.74,56.73 U5.38
  Bottom Layer w0.203: v3(37.47,56.01) 36.89,56.58 34.48,56.58 30.46,60.6 24.03,60.6 19.47,56.05 10.33,56.05 9.02,54.74 8,54.74 P1.20
GP27: length 39.2
  Top Layer w0.203: v3(37.47,56.9) 37.23,57.13 U5.39
  Bottom Layer w0.203: P1.18 8.2,57.15 12.01,60.96 30.65,60.96 34.31,57.3 37.06,57.3 v3(37.47,56.9)
GP28: length 39.5
  Top Layer w0.203: U5.40 37.97,57.53 v3(38.05,57.61)
  Bottom Layer w0.203: P1.14 8.64,62.99 20.07,62.99 21.64,61.42 30.69,61.42 34.45,57.66 37.21,57.66 37.24,57.61 v3(38.05,57.61)
GP29: length 47.2
  Top Layer w0.203: v3(38.66,58.17) 36.88,58.17 36.65,57.93 U5.41
  Bottom Layer w0.203: P1.8 7.37,69.85 6.71,69.19 6.71,66.45 7.11,66.04 17.54,66.04 17.54,66.02 21.79,61.77 30.84,61.77 30.88,61.72 31.04,61.72 34.75,58.01 36.02,58.01 36.17,58.17 v3(38.66,58.17)
HSYNC: length 19.7
  Top Layer w0.203: R39.2 59.9,30 65,30 67.56,27.43 67.56,23.52 66.54,22.5
RUN: length 174.4
  Top Layer w0.203: 45.47,15.5 67.06,15.5 73.25,21.69 SW3.1 ; 45.47,15.5 27.69,15.5 23.75,11.56 13.33,11.56 7.37,17.53 7.37,23.62 3.05,27.94 3.05,49.15 4.7,50.8 5.94,50.8 7.21,52.07 P1.22 ; 45.47,15.5 45.47,33.74 29.51,49.7 U5.26
SD-VCC: length 10.4
  Top Layer w0.61: CARD2.4 14.85,16 C15.1 20.46,17.55 21,18.09 R29.2
USB-DM: length 40.7
  Top Layer w0.203: 65.97,87.25 66.02,87.3 66.02,88.02 66.25,88.25 USB2.A7 ; 65.97,87.25 USB2.B7 ; 65.97,87.25 65.66,87.25 v3(65.53,87.12) ; v3(48.01,74.42) 47.96,74.47 41.1,74.47 40.4,75.17 U7.6
  Bottom Layer w0.203: v3(65.53,87.12) 64.26,88.39 60.07,88.39 49.02,77.35 49.02,74.68 48.77,74.42 v3(48.01,74.42)
USB-DP: length 41.9
  Top Layer w0.203: 68.25,87.75 68.33,87.83 v3(68.33,87.88) ; 68.25,87.75 USB2.A6 ; 68.25,87.75 68.25,88.5 68,88.75 USB2.B6 ; U7.5 40.4,76.44 41.1,75.74 47.96,75.74 v3(48.01,75.69)
  Bottom Layer w0.203: v3(48.01,75.69) 48.01,76.83 59.94,88.77 67.44,88.77 v3(68.33,87.88)
VSYNC: length 24
  Top Layer w0.203: R40.2 56.41,36.55 61.96,31 64.88,31 68.07,27.81 68.07,21.74 66.54,20.21
$1N16226: length 7.1
  Top Layer w0.203: 61.46,24.79 60.89,24.22 R38.2 56.5,24.27 R15.2
$1N16303: length 5
  Top Layer w0.203: 61.46,22.5 61.44,22.48 R13.2
$1N16324: length 5.3
  Top Layer w0.203: 61.46,27.08 60.56,27.98 R14.2
$1N17160: length 17.9
  Top Layer w0.203: 30.83,66.5 32.29,66.5 32.73,66.06 32.73,65.16 32.19,64.62 25.63,64.62 25.3,64.29 24.92,64.29 24.28,63.65 24.28,61.95 24.74,61.49 25.5,61.49 26.71,60.29 U5.52
$1N17190: length 19.3
  Top Layer w0.203: U5.51 27.11,60.39 25.65,61.85 24.89,61.85 24.64,62.1 24.64,63.41 25.16,63.93 25.45,63.93 25.78,64.26 32.34,64.26 33.09,65.01 33.09,67.16 32.5,67.75 30.86,67.75
$1N17220: length 10.9
  Top Layer w0.203: 24.83,66.75 23.5,66.75 22.73,65.98 22.73,62.36 24.31,60.78 25.12,60.78 25.91,59.99 U5.54
$1N17286: length 12.1
  Top Layer w0.203: U5.55 25.51,59.89 24.97,60.43 24.16,60.43 22.38,62.2 22.38,67.13 23,67.75 24.56,67.75
$1N17350: length 18.2
  Top Layer w0.203: 24,69 21.46,69 21.46,62.48 24.74,59.2 25.03,59.2 U5.56 ; R23.1 24.18,69.11
$1N17556: length 13.9
  Top Layer w0.203: U6.5 31.19,65.25 25.75,65.25 25.15,64.64 24.78,64.64 23.93,63.79 23.93,61.8 24.59,61.14 25.27,61.14 26.31,60.1 U5.53
$1N17761: length 6.3
  Top Layer w0.203: R5.2 27.53,47.25 27,47.25 26.5,47.75 26.5,50 27.51,51.01 U5.21
$1N25166: length 4.4
  Top Layer w0.203: LED1.2 8.24,84.58 R3.2
$1N89274: length 1.9
  Top Layer w0.203: R31.2 66.32,89.75 USB2.B5
$1N89558: length 1.9
  Top Layer w0.203: R32.2 66.32,86.75 USB2.A5
$1N90266: length 19.3
  Top Layer w0.203: USB2.1 67.56,83.5 R33.2
  Top Layer w0.61: USB2.1 USB2.3 72.39,84.16 72.39,91.84 USB2.4 USB2.2
$1N149316: length 17.3
  Top Layer w0.203: 41.66,31.59 40.98,30.91 30.91,30.91 28.32,28.32 U14.6
$1N153138: length 21.3
  Top Layer w0.203: 32.33,80.33 R42.2 32,81.73 33.17,82.91 33.17,87.33 34.75,88.9 43.6,88.9 VR1.5
$1N153144: length 49.9
  Top Layer w0.203: R43.2 23.29,79.96 22.99,80.26 22.99,94.32 24.81,96.15 42.35,96.15 46.5,92 46.5,87.14 45.72,86.36 44.14,86.36 VR1.3
$1N153495: length 5.2
  Top Layer w0.203: 52.96,62.5 52.58,62.12 52.58,58.73 52.38,58.53 U9.4
$1N153498: length 3.4
  Top Layer w0.203: U9.3 48.21,59.17 C50.2
$1N153501: length 5.7
  Top Layer w0.203: 52.96,83 52.58,82.62 52.58,78.87 52.21,78.5 51.38,78.5 U8.4
$1N153504: length 2.9
  Top Layer w0.203: U8.3 48.71,79.17 48.53,79
$1N153940: length 12.4
  Top Layer w0.203: R44.1 52.5,57.86 53.21,58.57 53.21,60.71 53.47,60.96 53.47,63.25 53.21,63.5 51.56,63.5 51.15,63.09 51.15,60.68 U9.1
$1N153979: length 13.9
  Top Layer w0.203: 52.5,76 52.5,78.28 53.13,78.91 53.13,81.07 53.5,81.44 53.5,83.79 53.21,84.07 51.69,84.07 51.35,83.74 U8.1
$1N157558: length 90.5
  Top Layer w0.203: 20.23,69.25 23.88,72.9 33.02,72.9 43.84,62.08 43.84,56.36 50.67,49.53 57.15,49.53 60.13,52.51 60.13,57.47 59.18,58.42 59.18,60.74 60.93,62.48 61.21,62.48 62.48,63.75 v1(64.01,63.75)
  Bottom Layer w0.203: SW4.1 70.85,50 66.5,54.35 66.5,63.25 65.99,63.75 v1(64.01,63.75)
$1N174548: length 5.5
  Top Layer w0.508: 54.48,62.85 54.48,63.63 53.54,64.57 50.16,64.57
$1N174627: length 2.4
  Top Layer w0.508: 57.07,82.93 54.66,82.93 54.66,82.94
$1N175144: length 4.9
  Top Layer w0.508: L22.2 29.87,92.46 27.83,92.46 R34.1
$1N175189: length 3.5
  Top Layer w0.203: R35.1 18.52,93.4 20.88,95.76
$1N177798: length 16.2
  Top Layer w0.355: L16.2 60.03,68.74 61.98,66.8 61.98,64.52 60.96,63.5 60.45,63.5 57.91,60.96 57.91,59.18 57.23,58.5 55.67,58.5 U9.5
$1N177837: length 14.9
  Top Layer w0.355: U9.8 55.88,60.71 55.88,66.04 58.67,68.83 58.67,72.64 59.03,73 L17.2
$1N177874: length 5.2
  Top Layer w0.355: 60.03,76.5 58.01,78.53 U8.5
$1N177913: length 4.8
  Top Layer w0.355: U8.8 59.06,80.47 60.03,79.5
$1N177952: length 4.6
  Top Layer w0.203: 35.18,85.67 37.18,85.67 VR1.4
$1N177953: length 36.9
  Top Layer w0.203: C50.1 45.97,67.94 48.77,70.74 48.77,75.95 47.68,77.03 45.97,77.03 44.25,78.75 44.25,80.97 43.17,82.06 41.51,82.06 41.02,82.55 41.02,83.44 40.51,83.95 35.38,83.95 35.18,83.74
$1N177995: length 10.3
  Top Layer w0.203: 46.47,79.39 46.47,79 ; 42.09,85.09 41.38,84.38 41.38,82.83 41.78,82.42 43.31,82.42 44.7,81.03 44.7,79.76 45.21,79.25 C49.1
$1N177996: length 4
  Top Layer w0.203: VR1.2 42.14,86.36 42.8,86.36 44.02,85.14 44.02,85.09
$1N185446: length 6.1
  Top Layer w0.203: R5.1 27.44,45.64 X1.1 26.51,45.18 C70.2 24.56,44.46 C68.2
$1N185458: length 20.2
  Top Layer w0.203: 26.14,47.6 26.16,47.59 ; 26.14,47.6 23.98,45.44 23.98,42.52 24.84,41.66 27.86,41.66 X1.3 29.53,43.32 C69.2 32.08,43.32 C67.2 ; 26.14,47.6 26.14,50.27 27.11,51.24 U5.20
$1N185779: length 54.2
  Top Layer w0.203: 30,80.56 R42.1 ; C74.2 27.14,76.76 16.56,76.76 10.45,82.87 10.45,85.25 CN3.2 8.94,86.87 7.11,88.7 7.11,92.46 7.62,92.96 8.84,92.96 CN3.2
  Top Layer w0.508: C74.2 28.28,77.9 C72.2 ; C62.2 32.63,89.92 32.63,85.71 32.12,85.2 C64.2 29.69,83.5 L1.2 28.28,82.47 C72.2 ; C72.2 R42.1
$1N185780: length 14.7
  Top Layer w0.203: 27.23,88.34 27.25,88.32 ; 26.59,90.92 C57.2 ; 26.59,90.92 26.59,89.16 L1.1 ; 26.59,90.92 R34.2
  Top Layer w0.508: C62.1 31.55,86.75 C64.1 28.97,86.6 27.25,88.32 L1.1 29.5,88.5
$1N185905: length 44.9
  Top Layer w0.203: L2.2 21.25,80.74 21.25,80.26 R43.1 ; 17.31,80.72 16.71,80.72 11.43,86 11.43,92.71 9.91,94.23 6.1,94.23 5.44,93.58 CN3.3
  Top Layer w0.508: C76.2 12.5,89.52 12.5,86.16 13.11,85.55 13.98,85.55 C77.2 16.05,83.48 L2.2 17.31,82.28 C73.2 C75.2
$1N185906: length 13.9
  Top Layer w0.203: R35.2 18.52,88.61
  Top Layer w0.508: C76.1 14.02,86.91 C77.1 16.88,86.86 L2.1 18.51,88.6 C71.2
$1N188762: length 22.4
  Top Layer w0.203: USB5.3 65.25,61.25 63.28,61.25 62.53,60.5 62.53,54.28 57.02,48.77 54.09,48.77 54.5,48.36 R58.2
$1N188763: length 42.8
  Top Layer w0.203: U5.47 28.71,60.96 29.14,61.39 29.14,63.51 29.35,63.71 32.29,63.71 33.44,64.87 33.44,65.69 34.43,66.67 38.48,66.67 43.28,61.87 43.28,55.52 50.05,48.75 50.07,48.77 52.59,48.77 52.59,46.91 R58.1
$1N188841: length 22.6
  Top Layer w0.203: 54.35,42.77 54.54,42.97 54.54,44.64 54.71,44.81 55.32,44.81 63.37,52.86 63.37,58.62 64.8,60.05 USB5.2
$1N188842: length 44.6
  Top Layer w0.203: U5.46 29.11,60.36 29.5,60.75 29.5,63.27 29.59,63.35 32.49,63.35 33.8,64.66 33.8,65.42 34.67,66.29 38.23,66.29 42.77,61.75 42.77,53.7 51.82,44.65 52.52,44.65 52.84,44.34 52.84,42.77
$1N189613: length 9.8
  Top Layer w0.508: U13.4 69.93,69.14 64.43,69.14 C43.2 62.41,69.56 L16.1
$1N189618: length 12.6
  Top Layer w0.508: U13.3 68.92,73.95 66.06,73.95 ; NOREF.58 66.04,73.93 66.06,73.95 ; 66.06,73.95 C42.2 63.48,73.95 62.53,73 L17.1
$1N189623: length 11.4
  Top Layer w0.508: 61.92,76.46 L18.1 62.47,75.91 C45.2 64.78,75.13 66.04,75.13 ; 66.04,75.13 70.38,75.13 U13.2 ; 66.04,75.13 NOREF#3.58
$1N189653: length 9.4
  Top Layer w0.508: L19.1 62.47,79.79 C44.2 65.52,79.79 66.04,79.27 70.71,79.27 U13.1

## Copper pours and planes (outline as drawn; the poured copper is in the pictures)
GND on Bottom Layer: 74.99,0.14 -0.01,0.14 -0.01,100.14 74.99,100.14
A-GND on Top Layer: 0.05,79.65 9.4,79.65 9.4,77.12 33.83,77.12 33.83,82.55 44.57,82.59 44.57,53.52 58.99,53.52 58.99,65.13 74.99,65.1 75.05,100 0.05,100

## Text on the board
Bottom Silkscreen Layer: 5V ,GP0 | 5V ,GP1 | GND,GND | GP29,GP2 | 3V3 ,GP3 | 3V3 ,GP4 | GP28,GP5 | GND ,GND | GP27,GP6 | GP26,GP7 | RUN ,GP8 | GP22,GP9 | GP21,GP10 | GP20,GP11 | GP19,GP12 | GP18,GP13 | GP17,GP14 | GP16,GP15 | BOOT | RESET | R- | L+ | R+ | L- | Configuration: Enter in this order / OPTION PICO OFF / OPTION SYSTEM I2C GP14,GP15 / OPTION SDCARD GP13, GP10, GP11, GP12 / OPTION KEYBOARD UK/US/BE/ES/FR/GR / OPTION RTC AUTO ENABLE (optional) / OPTION VGA PINS GP23,GP18 / OPTION AUDIO GP16,GP17
Top Silkscreen Layer: PicoMiteVGA / USB Edition V1.1 / PCB Peter Mather / MMBasic Geoff Graham / & Peter Mather | GP0,5V | GP1 ,5V | GND ,GND | GP2 ,GP29 | GP3 ,3V3 | GP4 ,3V3 | GP6 ,GP28 | GP6 ,GP27 | GP7 ,G26 | GP8  ,RUN | GP9 ,GP22 | GP10,GP21 | GP11,GP20 | GP12,GP19 | GP13,GP18 | GP14,GP17 | GP15,GP16 | CR2032 | AMP | RESET | BOOT
